# EAGLE design piezo-buffer-and-preamp-ritter_V0-1 (EAGLE 7.5.0)
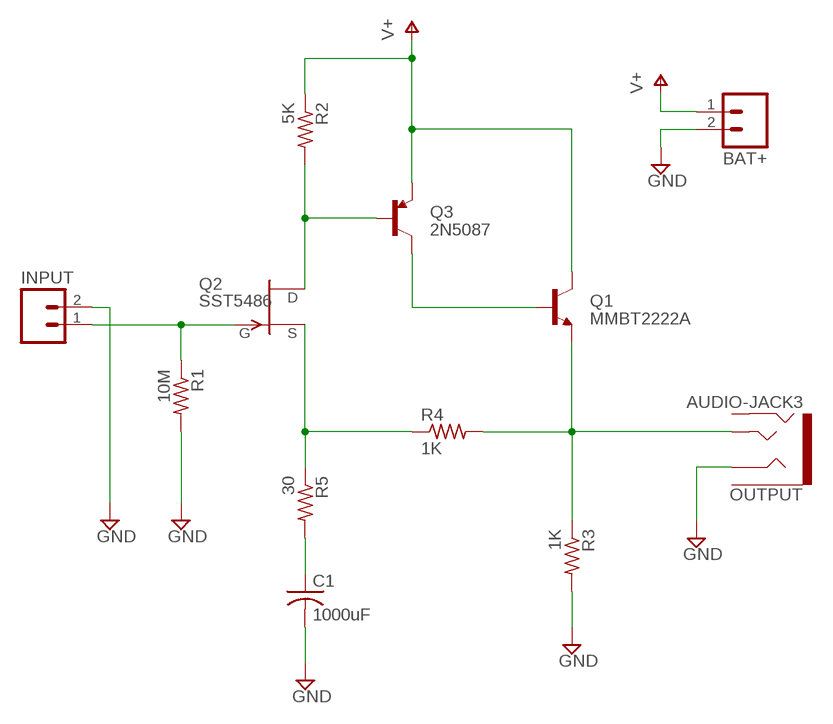
[diagram p0: schematic, sheet 1]

## Parts
BAT+  M02LOCK  [1X02_LOCK]
C1  1000uF  C-USC0805  [C0805]
INPUT  M02LOCK  [1X02_LOCK]
OUTPUT  AUDIO-JACK3  [AUDIO-JACK-TRRS-SMD]
Q1  MMBT2222A  TRANSISTOR_NPN  [SOT23]
Q2  SST5486  [SOT23]
Q3  2N5087  TRANSISTOR_PNP  [SOT23]
R1  10M  R-US_R0805  [R0805]
R2  5K  R-US_R0805  [R0805]
R3  1K  R-US_R0805  [R0805]
R4  1K  R-US_R0805  [R0805]
R5  30  R-US_R0805  [R0805]

## Nets
GND: BAT+.2 C1.2 INPUT.2 OUTPUT.RING1 R1.2 R3.2
N$1: INPUT.1 Q2.3(G) R1.1
N$2: Q2.1(D) Q3.1(B) R2.2
N$3: OUTPUT.TIP Q1.2(E) R3.1 R4.2
N$4: Q2.2(S) R4.1 R5.1
N$5: Q1.1(B) Q3.3(C)
N$6: C1.1 R5.2
V+: BAT+.1 Q1.3(C) Q3.2(E) R2.1
Unconnected: OUTPUT.EARTH OUTPUT.RING2

## Library data of the parts
BAT+ INPUT = CMU-ArtFab:M02: Header 2 Standard 2-pin 0.1" header. Use with straight break away headers (SKU : PRT-00116), right angle break away headers (PRT-00553), swiss pins (PRT-00743), machine pins (PRT-00117), and female headers (PRT-00115). Molex polarized connector foot print use with SKU : PRT-08233 with associated crimp pins and housings.
C1 = rcl:C-US: CAPACITOR, American symbol
OUTPUT = SparkFun-Connectors:AUDIO-JACK3: Audio jack - 3.5mm TRRS variety - two rings.
Q1 = CMU-ArtFab:TRANSISTOR_NPN: Generic NPN BJT MMBT2222A - TRANS-08049 (SOT-23, 1A 40V) MPSA42 - TRANS-09116 (SOT-23, 500mA 300V) MMBT5088LT1G - TRANS-11160 (SOT-23, 50 mA 30V) BC547 - COM-08928 <http://www.sparkfun.com/products/8928> (TO-92 45V 100mA) (1.Collector 2.Base 3.Emitter) 2N3904 - COM-00521 <http://www.sparkfun.com/products/521> (TO-92 40V 200mA) (1.Emitter 2.Base 3.Collector) P2N2222A - COM-12852 <http://www.sparkfun.com/products/12852> (TO-92 40V 600mA) (1.Collector 2.Base 3.Emitter)
Q2 = transistor-fet:?548*: N-Channel JFETs Source: VISHAY 2N5484.pdf Compatible: TO92 2N5245 J304 J305 U310 J308 J309 J310 TO72 2N4416 2N4416A 2N3823 2N4351 3N169 3N170 3N171 MFE3002 TO18 2N3796 2N3797 MFE825 Source: Motorola European Master Guide Pacge 3-59
Q3 = CMU-ArtFab:TRANSISTOR_PNP: Generic PNP BJT Double check pinouts against datasheets- not all devices are the same! MMBT3906 - 40V 200mA SOT-23 (TRANS-08052) MMBT4403 - 40V 600mA SOT-23 (TRANS-09245)
R1-R5 = resistor:R-US_: RESISTOR, American symbol

## Board
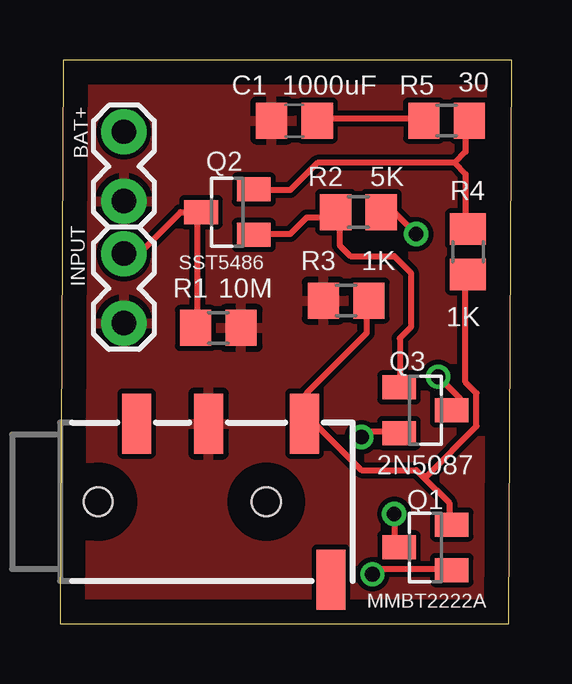
[diagram p1: board, top side]
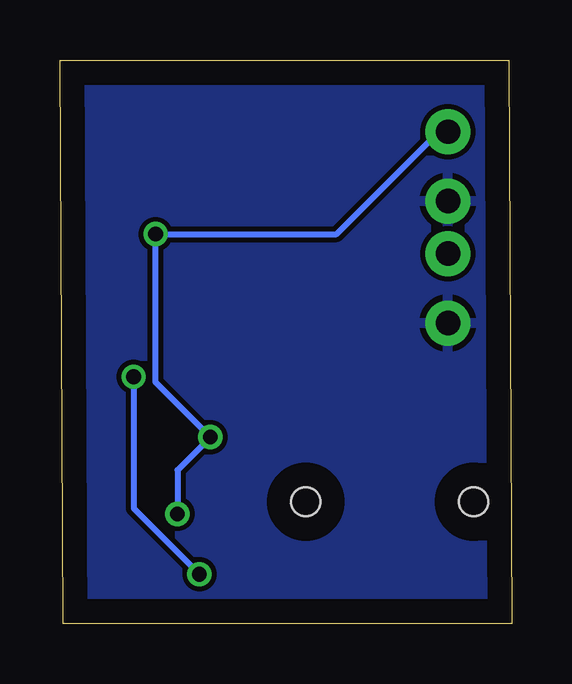
[diagram p2: board, bottom side, seen from below]

Size 18.85 x 23.48 mm. Coordinates in mm from the lower left corner, seen from the top.
Outline: 0,0 18.72,0 18.85,23.48 0.13,23.48 0,0
Copper layers (1*16): Top 0.035mm / dielectric 1.5mm / Bottom 0.035mm
Design rules "default": minimum track width 10mil, minimum drill 24mil, track to track 8mil, track to pad 8mil, pad to pad 8mil, via to via 8mil, smd to smd 8mil, copper to edge 40mil, drill to drill 8mil, minimum pad ring 10mil, minimum via ring 8mil, stop-mask expansion 4mil, vias tented up to drill 0mil, thermal gap 10mil

### Footprints (pad centres in the part's own frame; a part is rotated, then mirrored left to right if it is on the bottom)
1X02_LOCK = drill 1.016 pad 1.88: 1 -0.178,0; 2 2.718,0
C0805 = smd 1.3 x 1.5: 1 -0.95,0; 2 0.95,0
AUDIO-JACK-TRRS-SMD = smd 1.2 x 2.5: EARTH 11.3,-3.25; RING1 6.2,3.25; RING2 3.2,3.25; TIP 10.2,3.25 | hole 1.2: 1.6,0; 8.6,0
SOT23 = smd 1 x 1.4: 1 -0.95,-1.1; 2 0.95,-1.1; 3 0,1.1
R0805 = smd 1.3 x 1.5: 1 -0.95,0; 2 0.95,0

### Placement (x,y rotation side)
BAT+  2.67,20.32 270 top
C1  9.78,20.95 180 top
INPUT  2.67,15.24 270 top
OUTPUT  0,5.08 0 top
Q1  15.24,3.17 90 top
Q2  6.99,17.14 90 top
Q3  15.24,8.89 270 top
R1  6.6,12.32 0 top
R2  12.45,17.14 180 top
R3  11.94,13.46 180 top
R4  17.02,15.49 270 top
R5  16.13,20.95 180 top

### Tracks (layer width: path | path; a pad name or v marks a point on that pad's centre or on a via)
GND
  pour Top: 0,0 19.05,0 19.05,22.86 0,22.86
  pour Bottom: 0,22.86 19.05,22.86 19.05,0 0,0
N$1
  Top 0.254: 5.71,17.14 5.03,17.14 3.43,15.54 2.74,15.54 INPUT.1 | 5.71,17.14 5.71,12.34 R1.1 | 5.71,17.14 Q2.3
N$2
  Top 0.254: 11.66,16.92 11.66,17.14 R2.2 11.66,16.92 | 11.66,16.92 11.66,15.77 12.12,15.32 13.95,15.32 14.63,14.63 14.63,12.34 14.17,11.89 14.17,10.06 Q3.1 | 11.66,16.92 10.29,16.92 9.6,16.23 8.23,16.23 Q2.1
N$3
  Top 0.254: 15.09,6.17 14.86,6.4 12.57,6.4 10.74,8.23 10.29,8.23 OUTPUT.TIP 10.29,8.46 10.29,9.6 12.8,12.12 12.8,13.26 R3.1 | 15.09,6.17 16.23,5.03 16.23,4.34 Q1.2 | 15.09,6.17 15.32,6.17 17.37,8.23 17.37,9.6 16.92,10.06 16.92,14.4 R4.2
N$4
  Top 0.254: 16.46,19.2 10.74,19.2 9.6,18.06 8.23,18.06 Q2.2 | 16.46,19.2 16.92,19.66 16.92,20.8 R5.1 | 16.46,19.2 16.92,18.75 16.92,16.46 R4.1
N$5  (via drill 0.61)
  Top 0.254: v13.03,2.06 13.26,2.29 16.23,2.29 Q1.1 | v15.77,10.29 16.69,9.37 16.69,9.14 16.46,8.91 Q3.3
  Bottom 0.254: v13.03,2.06 15.77,4.8 v15.77,10.29
N$6
  Top 0.254: C1.1 10.74,21.03 15.09,21.03 R5.2
V+  (via drill 0.61)
  Top 0.254: v13.95,4.57 13.95,3.2 Q1.3 | v12.57,7.77 12.8,8 13.95,8 Q3.2 | R2.1 13.95,17.14 v14.86,16.23
  Bottom 0.254: v13.95,4.57 13.95,6.4 v12.57,7.77 14.86,10.06 v14.86,16.23 7.32,16.23 3.2,20.34 2.74,20.34 BAT+.1